# EAGLE design develboard (EAGLE 5.02)

## Sheet 1 of 7
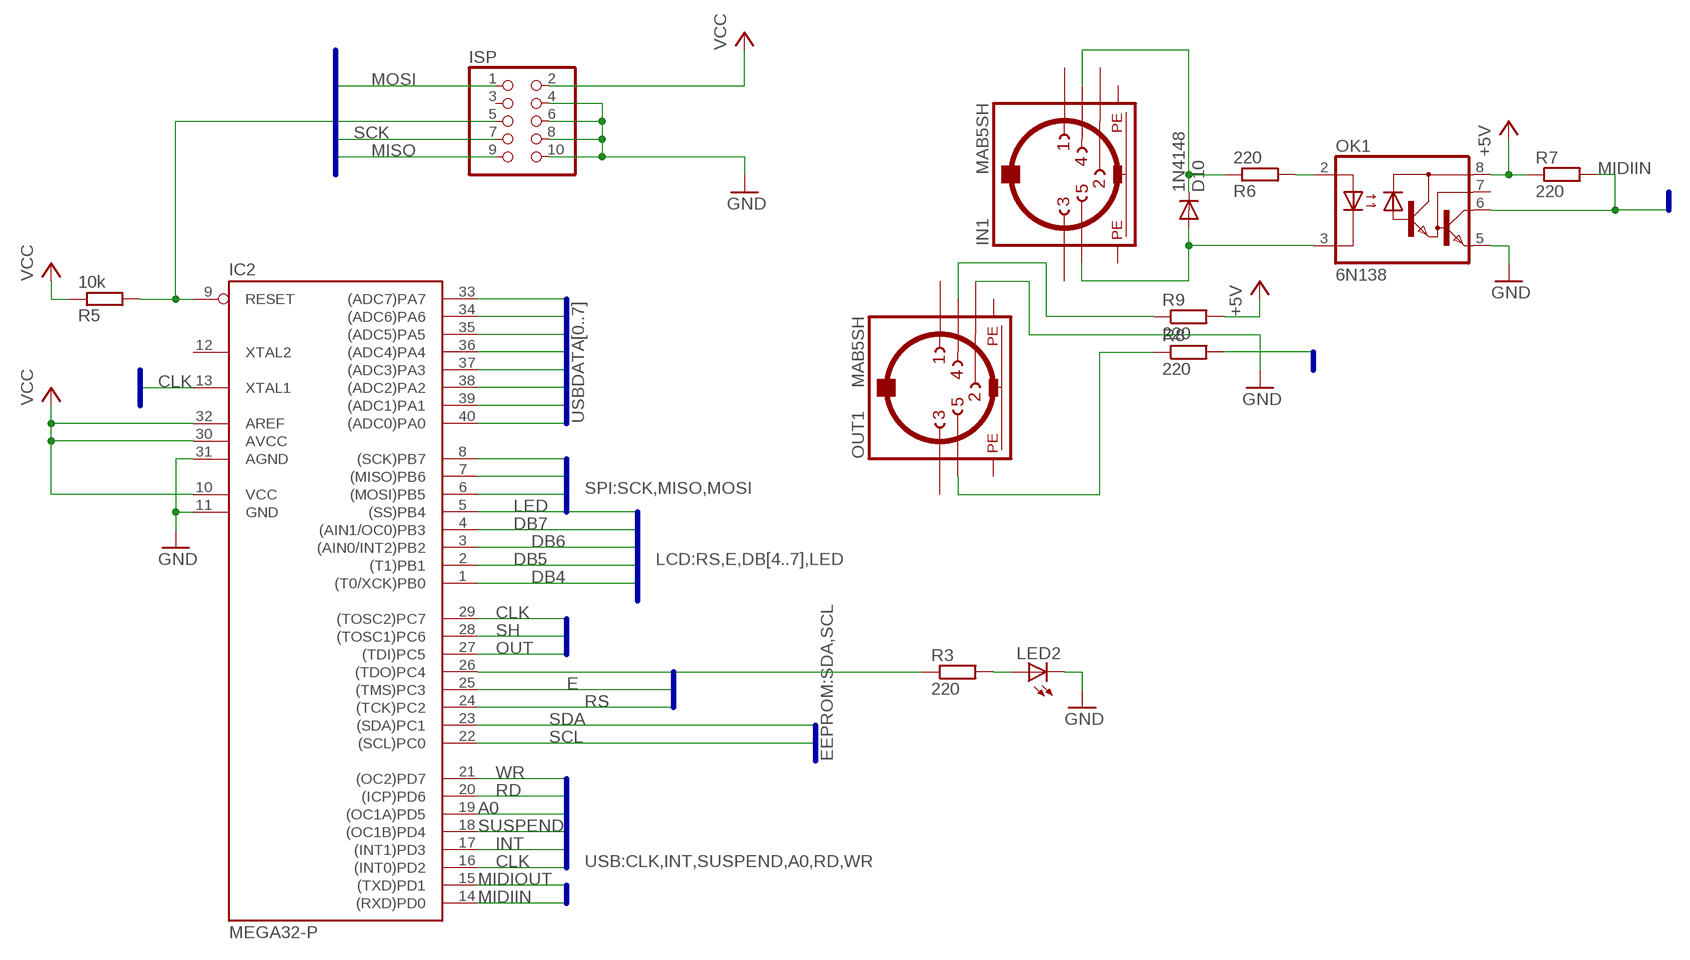
[diagram p0: schematic, sheet 1]

### Parts
D10  1N4148  [DO35-10]
IC2  MEGA32-P  [DIL40]
IN1  MAB5SH  [MAB5SH]
ISP  PINHD-2X5  [2X05]
LED2  LED5MM  [LED5MM]
OK1  6N138  [DIL08]
OUT1  MAB5SH  [MAB5SH]
R3  220  R-EU_0204/7  [0204/7]
R5  10k  R-EU_0204/7  [0204/7]
R6  220  R-EU_0204/7  [0204/7]
R7  220  R-EU_0204/7  [0204/7]
R8  220  R-EU_0204/7  [0204/7]
R9  220  R-EU_0204/7  [0204/7]

### Nets
A0: IC2.19((OC1A)PD5) ; also sheet 2
CLK: IC2.13(XTAL1) IC2.16((INT0)PD2) IC2.29((TOSC2)PC7) ; also sheet 2,6
DB4: IC2.1((T0/XCK)PB0) ; also sheet 7
DB5: IC2.2((T1)PB1) ; also sheet 7
DB6: IC2.3((AIN0/INT2)PB2) ; also sheet 7
DB7: IC2.4((AIN1/OC0)PB3) ; also sheet 7
E: IC2.25((TMS)PC3) ; also sheet 7
GND: IC2.11(GND) IC2.31(AGND) ISP.4 ISP.6 ISP.8 ISP.10 LED2.K(C) OK1.5(GND) OUT1.2 ; also sheet 2,3,4,5,6,7
INT: IC2.17((INT1)PD3) ; also sheet 2
LED: IC2.5((SS)PB4) ; also sheet 7
MIDIIN: IC2.14((RXD)PD0) OK1.6(VO) R7.2
MIDIOUT: IC2.15((TXD)PD1) R8.2
MISO: IC2.7((MISO)PB6) ISP.9
MOSI: IC2.6((MOSI)PB5) ISP.1
N$4: IC2.26((TDO)PC4) R3.1
N$7: LED2.A R3.2
N$10: D10.C IN1.4 R6.1
N$11: OUT1.4 R9.1
N$12: OUT1.5 R8.1
N$13: OK1.2(A) R6.2
N$20: D10.A IN1.5 OK1.3(C)
N$98: IC2.9(RESET) ISP.5 R5.2
OUT: IC2.27((TDI)PC5) ; also sheet 6
RD: IC2.20((ICP)PD6) ; also sheet 2
RS: IC2.24((TCK)PC2) ; also sheet 7
SCK: IC2.8((SCK)PB7) ISP.7
SCL: IC2.22((SCL)PC0) ; also sheet 7
SDA: IC2.23((SDA)PC1) ; also sheet 7
SH: IC2.28((TOSC1)PC6) ; also sheet 6
SUSPEND: IC2.18((OC1B)PD4) ; also sheet 2
USBDATA0: IC2.40((ADC0)PA0) ; also sheet 2
USBDATA1: IC2.39((ADC1)PA1) ; also sheet 2
USBDATA2: IC2.38((ADC2)PA2) ; also sheet 2
USBDATA3: IC2.37((ADC3)PA3) ; also sheet 2
USBDATA4: IC2.36((ADC4)PA4) ; also sheet 2
USBDATA5: IC2.35((ADC5)PA5) ; also sheet 2
USBDATA6: IC2.34((ADC6)PA6) ; also sheet 2
USBDATA7: IC2.33((ADC7)PA7) ; also sheet 2
VCC: IC2.10(VCC) IC2.30(AVCC) IC2.32(AREF) ISP.2 OK1.8(VCC) R5.1 R7.1 R9.2 ; supply symbol labelled +5V ; also sheet 2,3,4,5,6,7
WR: IC2.21((OC2)PD7) ; also sheet 2
Unconnected: IC2.12(XTAL2) IN1.1 IN1.2 IN1.3 ISP.3 OK1.7(VB) OUT1.1 OUT1.3

### Buses
MIDIOUT,MIDIIN
SPI:SCK,MISO,MOSI
SHR:CLK,SH,OUT
USBDATA[0..7]
USB:CLK,INT,SUSPEND,A0,RD,WR
EEPROM:SDA,SCL
LCD:RS,E,DB[4..7],LED

## Sheet 2 of 7
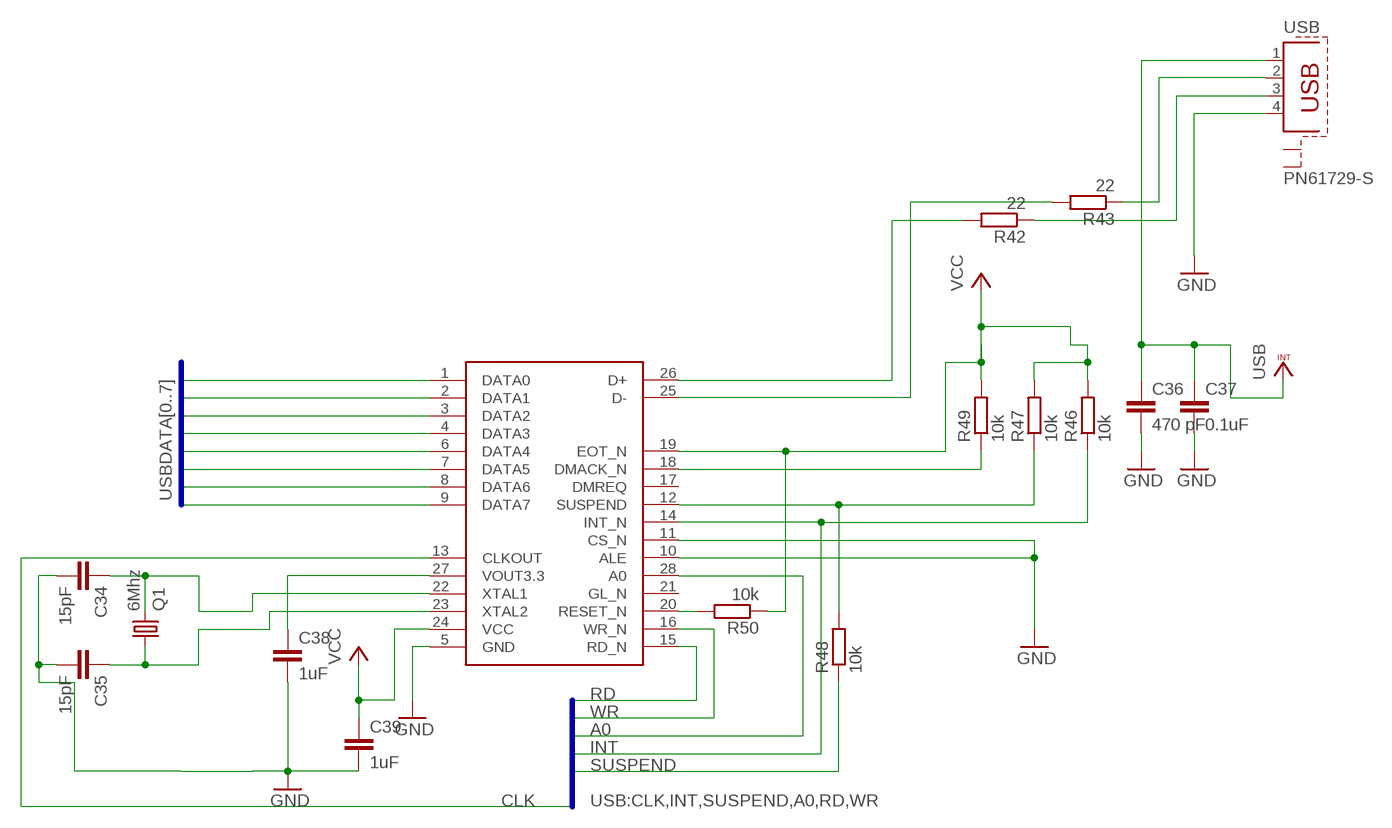
[diagram p1: schematic, sheet 2]

### Parts
C34  15pF  C-EUC0805  [C0805]
C35  15pF  C-EUC0805  [C0805]
C36  470 pF  C-EUC0805  [C0805]
C37  0.1uF  C-EUC0805  [C0805]
C38  1uF  C-EUC0805  [C0805]
C39  1uF  C-EUC0805  [C0805]
Q1  6Mhz  CRYSTALHC49S  [HC49/S]
R42  22  R-EU_R0805  [R0805]
R43  22  R-EU_R0805  [R0805]
R46  10k  R-EU_R0805  [R0805]
R47  10k  R-EU_R0805  [R0805]
R48  10k  R-EU_R0805  [R0805]
R49  10k  R-EU_R0805  [R0805]
R50  10k  R-EU_R0805  [R0805]
U$2  PDIUSBD12  [TSSOP28]
USB  PN61729-S  [PN61729-S]

### Nets
A0: U$2.28(A0) ; also sheet 1
CLK: U$2.13(CLKOUT) ; also sheet 1,6
GND: C34.2 C35.2 C36.2 C37.2 C38.2 C39.2 U$2.5(GND) U$2.10(ALE) U$2.11(CS_N) USB.4 ; also sheet 1,3,4,5,6,7
INT: R46.1 U$2.14(INT_N) ; also sheet 1
N$22: R43.1 USB.2
N$35: R49.1 U$2.18(DMACK_N)
N$36: R42.2 U$2.26(D+)
N$37: R43.2 U$2.25(D-)
N$38: C38.1 U$2.27(VOUT3.3)
N$45: R50.2 U$2.20(RESET_N)
N$46: C34.1 Q1.2 U$2.22(XTAL1)
N$47: C35.1 Q1.1 U$2.23(XTAL2)
N$48: R42.1 USB.3
N$51: R47.1 R48.2 U$2.12(SUSPEND)
RD: U$2.15(RD_N) ; also sheet 1
SUSPEND: R48.1 ; also sheet 1
USBDATA0: U$2.1(DATA0) ; also sheet 1
USBDATA1: U$2.2(DATA1) ; also sheet 1
USBDATA2: U$2.3(DATA2) ; also sheet 1
USBDATA3: U$2.4(DATA3) ; also sheet 1
USBDATA4: U$2.6(DATA4) ; also sheet 1
USBDATA5: U$2.7(DATA5) ; also sheet 1
USBDATA6: U$2.8(DATA6) ; also sheet 1
USBDATA7: U$2.9(DATA7) ; also sheet 1
VCC: C39.1 R46.2 R47.2 R49.2 R50.1 U$2.19(EOT_N) U$2.24(VCC) ; also sheet 1,3,4,5,6,7
VCCINT: C36.1 C37.1 USB.1 ; supply symbol labelled USB ; also sheet 3
WR: U$2.16(WR_N) ; also sheet 1
Unconnected: U$2.17(DMREQ) U$2.21(GL_N) USB.S1 USB.S2

### Buses
USBDATA[0..7]
USB:CLK,INT,SUSPEND,A0,RD,WR

## Sheet 3 of 7
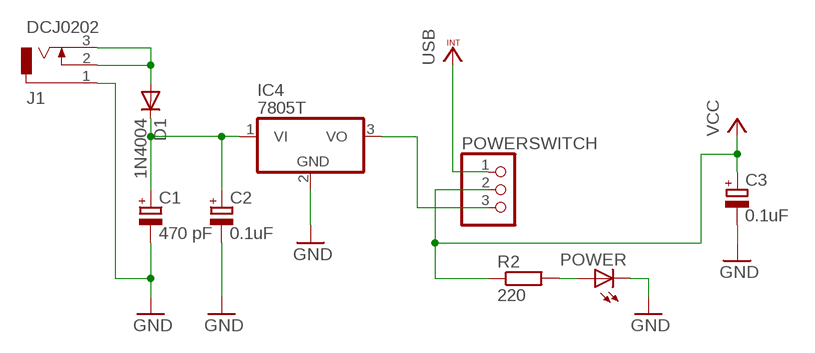
[diagram p2: schematic, sheet 3]

### Parts
C1  470 pF  CPOL-EUB45181B  [B45181B]
C2  0.1uF  CPOL-EUB45181B  [B45181B]
C3  0.1uF  CPOL-EUB45181B  [B45181B]
D1  1N4004  [DO41-10]
IC4  7805T  [TO220H]
J1  DCJ0202  [DCJ0202]
POWER  LED5MM  [LED5MM]
POWERSWITCH  PINHD-1X3  [1X03]
R2  220  R-EU_0204/7  [0204/7]

### Nets
GND: C1.- C2.- C3.- IC4.2(GND) J1.1 POWER.K(C) ; also sheet 1,2,4,5,6,7
N$3: D1.A J1.2 J1.3
N$5: POWER.A R2.2
N$21: C1.+ C2.+ D1.C IC4.1(VI)
N$23: IC4.3(VO) POWERSWITCH.3
VCC: C3.+ POWERSWITCH.2 R2.1 ; also sheet 1,2,4,5,6,7
VCCINT: POWERSWITCH.1 ; supply symbol labelled USB ; also sheet 2

## Sheet 4 of 7
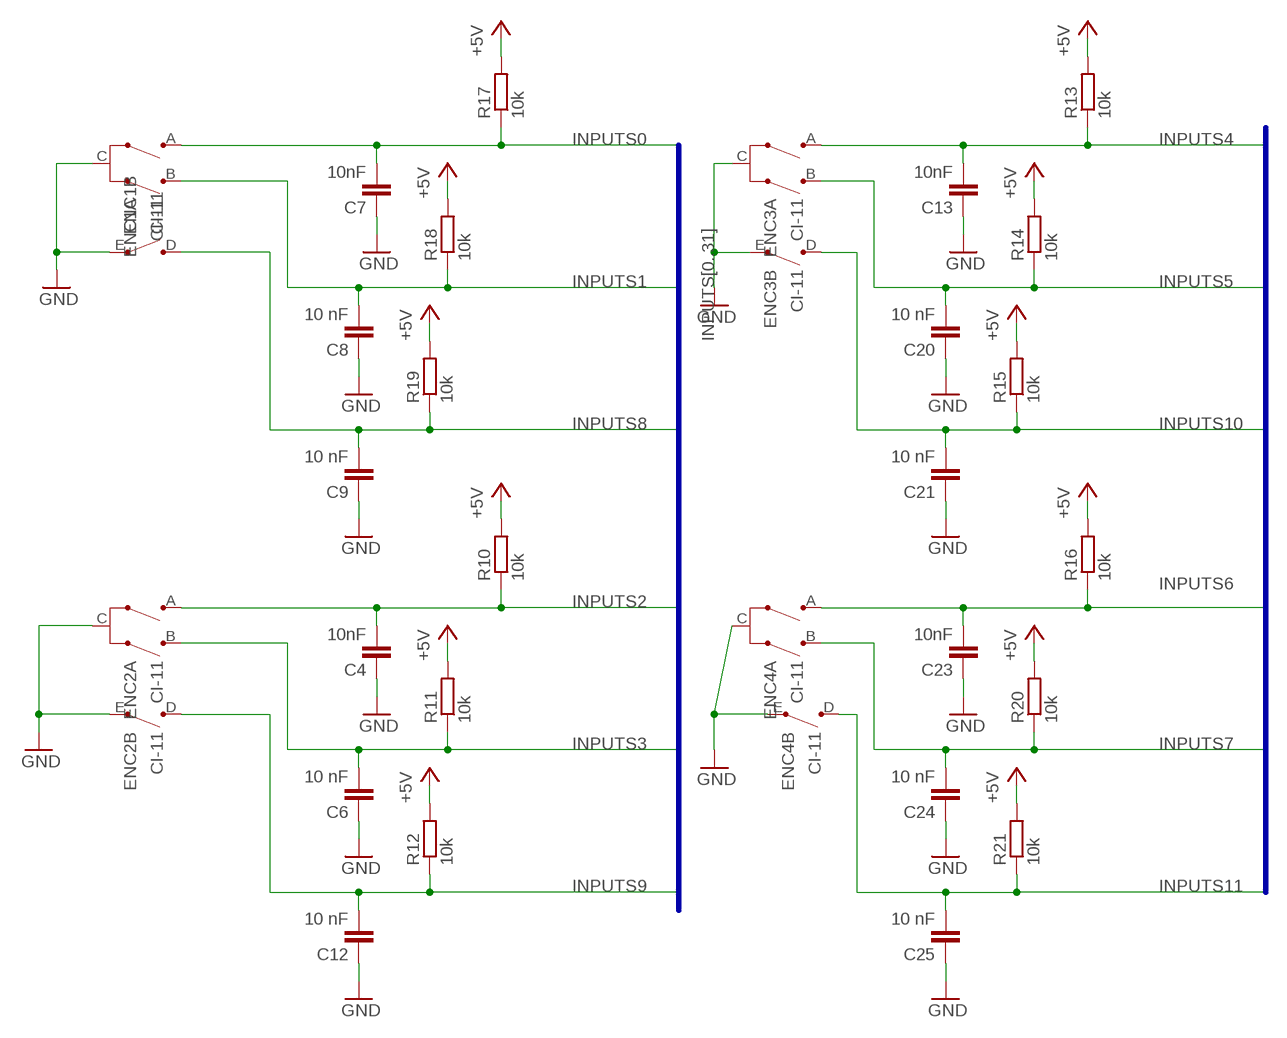
[diagram p3: schematic, sheet 4]

### Parts
C4  10nF  C-EU025-025X050  [C025-025X050]
C6  10 nF  C-EU025-025X050  [C025-025X050]
C7  10nF  C-EU025-025X050  [C025-025X050]
C8  10 nF  C-EU025-025X050  [C025-025X050]
C9  10 nF  C-EU025-025X050  [C025-025X050]
C12  10 nF  C-EU025-025X050  [C025-025X050]
C13  10nF  C-EU025-025X050  [C025-025X050]
C20  10 nF  C-EU025-025X050  [C025-025X050]
C21  10 nF  C-EU025-025X050  [C025-025X050]
C23  10nF  C-EU025-025X050  [C025-025X050]
C24  10 nF  C-EU025-025X050  [C025-025X050]
C25  10 nF  C-EU025-025X050  [C025-025X050]
ENC1  CI-11  [CI-11]
ENC2  CI-11  [CI-11]
ENC3  CI-11  [CI-11]
ENC4  CI-11  [CI-11]
R10  10k  R-EU_0204/7  [0204/7]
R11  10k  R-EU_0204/7  [0204/7]
R12  10k  R-EU_0204/7  [0204/7]
R13  10k  R-EU_0204/7  [0204/7]
R14  10k  R-EU_0204/7  [0204/7]
R15  10k  R-EU_0204/7  [0204/7]
R16  10k  R-EU_0204/7  [0204/7]
R17  10k  R-EU_0204/7  [0204/7]
R18  10k  R-EU_0204/7  [0204/7]
R19  10k  R-EU_0204/7  [0204/7]
R20  10k  R-EU_0204/7  [0204/7]
R21  10k  R-EU_0204/7  [0204/7]

### Nets
GND: C4.1 C6.1 C7.1 C8.1 C9.1 C12.1 C13.1 C20.1 C21.1 C23.1 C24.1 C25.1 ENC1.C(A:C) ENC1.E(B:E) ENC2.C(A:C) ENC2.E(B:E) ENC3.C(A:C) ENC3.E(B:E) ENC4.C(A:C) ENC4.E(B:E) ; also sheet 1,2,3,5,6,7
INPUTS0: C7.2 ENC1.A(A:A) R17.1 ; also sheet 6
INPUTS1: C8.2 ENC1.B(A:B) R18.1 ; also sheet 6
INPUTS2: C4.2 ENC2.A(A:A) R10.1 ; also sheet 6
INPUTS3: C6.2 ENC2.B(A:B) R11.1 ; also sheet 6
INPUTS4: C13.2 ENC3.A(A:A) R13.1 ; also sheet 6
INPUTS5: C20.2 ENC3.B(A:B) R14.1 ; also sheet 6
INPUTS6: C23.2 ENC4.A(A:A) R16.1 ; also sheet 6
INPUTS7: C24.2 ENC4.B(A:B) R20.1 ; also sheet 6
INPUTS8: C9.2 ENC1.D(B:D) R19.1 ; also sheet 6
INPUTS9: C12.2 ENC2.D(B:D) R12.1 ; also sheet 6
INPUTS10: C21.2 ENC3.D(B:D) R15.1 ; also sheet 6
INPUTS11: C25.2 ENC4.D(B:D) R21.1 ; also sheet 6
VCC: R10.2 R11.2 R12.2 R13.2 R14.2 R15.2 R16.2 R17.2 R18.2 R19.2 R20.2 R21.2 ; supply symbol labelled +5V ; also sheet 1,2,3,5,6,7

### Buses
INPUTS[0..31]

## Sheet 5 of 7
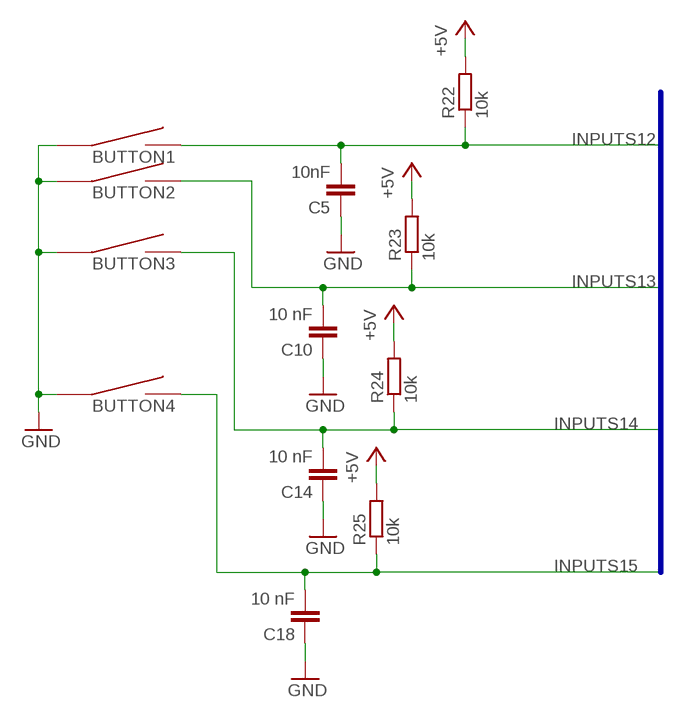
[diagram p4: schematic, sheet 5]

### Parts
BUTTON1  3FTL  [3FTL06]
BUTTON2  3FTL  [3FTL06]
BUTTON3  3FTL  [3FTL06]
BUTTON4  3FTL  [3FTL06]
C5  10nF  C-EU025-025X050  [C025-025X050]
C10  10 nF  C-EU025-025X050  [C025-025X050]
C14  10 nF  C-EU025-025X050  [C025-025X050]
C18  10 nF  C-EU025-025X050  [C025-025X050]
R22  10k  R-EU_0204/7  [0204/7]
R23  10k  R-EU_0204/7  [0204/7]
R24  10k  R-EU_0204/7  [0204/7]
R25  10k  R-EU_0204/7  [0204/7]

### Nets
GND: BUTTON1.A@1 BUTTON2.A@1 BUTTON3.A@1 BUTTON4.A@1 C5.1 C10.1 C14.1 C18.1 ; also sheet 1,2,3,4,6,7
INPUTS12: BUTTON1.B@1 C5.2 R22.1 ; also sheet 6
INPUTS13: BUTTON2.B@1 C10.2 R23.1 ; also sheet 6
INPUTS14: BUTTON3.B@1 C14.2 R24.1 ; also sheet 6
INPUTS15: BUTTON4.B@1 C18.2 R25.1 ; also sheet 6
VCC: R22.2 R23.2 R24.2 R25.2 ; supply symbol labelled +5V ; also sheet 1,2,3,4,6,7

### Buses
INPUTS[0..31]

## Sheet 6 of 7
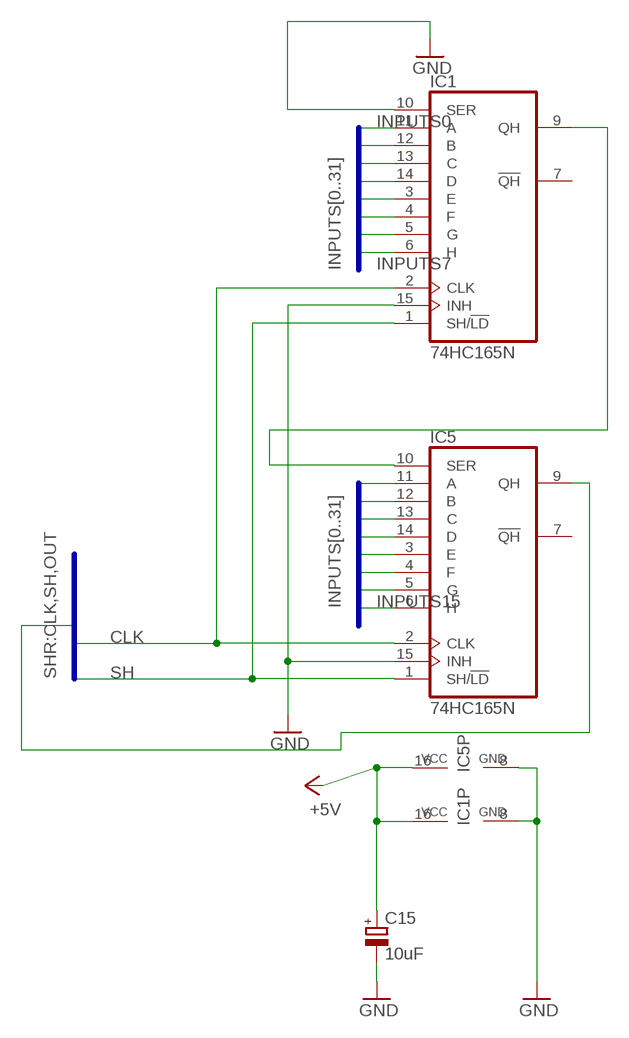
[diagram p5: schematic, sheet 6]

### Parts
C15  10uF  CPOL-EUB45181B  [B45181B]
IC1  74HC165N  [DIL16]
IC5  74HC165N  [DIL16]

### Nets
CLK: IC1.2(CLK) IC5.2(CLK) ; also sheet 1,2
GND: C15.- IC1.8(GND) IC1.10(SER) IC1.15(INH) IC5.8(GND) IC5.15(INH) ; also sheet 1,2,3,4,5,7
INPUTS0: IC1.11(A) ; also sheet 4
INPUTS1: IC1.12(B) ; also sheet 4
INPUTS2: IC1.13(C) ; also sheet 4
INPUTS3: IC1.14(D) ; also sheet 4
INPUTS4: IC1.3(E) ; also sheet 4
INPUTS5: IC1.4(F) ; also sheet 4
INPUTS6: IC1.5(G) ; also sheet 4
INPUTS7: IC1.6(H) ; also sheet 4
INPUTS8: IC5.11(A) ; also sheet 4
INPUTS9: IC5.12(B) ; also sheet 4
INPUTS10: IC5.13(C) ; also sheet 4
INPUTS11: IC5.14(D) ; also sheet 4
INPUTS12: IC5.3(E) ; also sheet 5
INPUTS13: IC5.4(F) ; also sheet 5
INPUTS14: IC5.5(G) ; also sheet 5
INPUTS15: IC5.6(H) ; also sheet 5
N$1: IC1.9(QH) IC5.10(SER)
OUT: IC5.9(QH) ; also sheet 1
SH: IC1.1(SH/!LD) IC5.1(SH/!LD) ; also sheet 1
VCC: C15.+ IC1.16(VCC) IC5.16(VCC) ; supply symbol labelled +5V ; also sheet 1,2,3,4,5,7
Unconnected: IC1.7(!QH) IC5.7(!QH)

### Buses
INPUTS[0..31]
SHR:CLK,SH,OUT

## Sheet 7 of 7
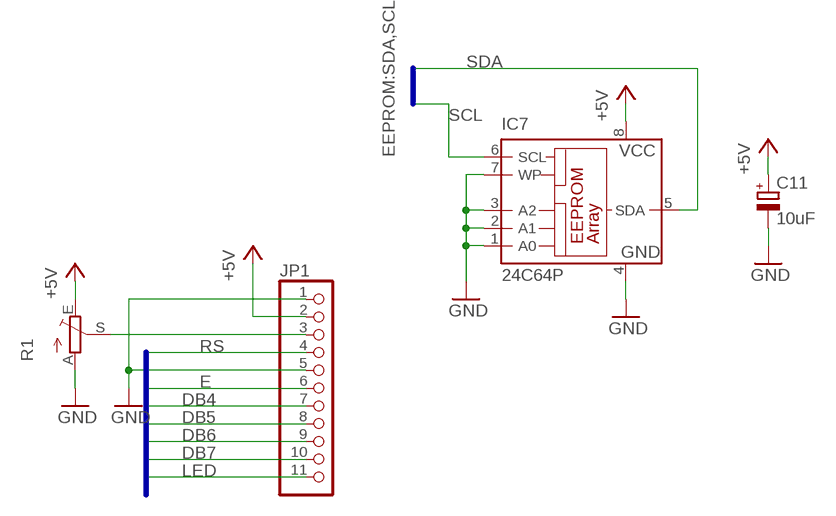
[diagram p6: schematic, sheet 7]

### Parts
C11  10uF  CPOL-EUB45181A  [B45181A]
IC7  24C64P  [DIL8]
JP1  PINHD-1X11  [1X11]
R1  TRIM_EU-CA6V  [CA6V]

### Nets
DB4: JP1.7 ; also sheet 1
DB5: JP1.8 ; also sheet 1
DB6: JP1.9 ; also sheet 1
DB7: JP1.10 ; also sheet 1
E: JP1.6 ; also sheet 1
GND: C11.- IC7.1(A0) IC7.2(A1) IC7.3(A2) IC7.4(GND) IC7.7(WP) JP1.1 JP1.5 R1.A ; also sheet 1,2,3,4,5,6
LED: JP1.11 ; also sheet 1
N$2: JP1.3 R1.S
RS: JP1.4 ; also sheet 1
SCL: IC7.6(SCL) ; also sheet 1
SDA: IC7.5(SDA) ; also sheet 1
VCC: C11.+ IC7.8(VCC) JP1.2 R1.E ; supply symbol labelled +5V ; also sheet 1,2,3,4,5,6

### Buses
LCD:RS,E,DB[4..7],LED
EEPROM:SDA,SCL

## Power pins joined to a net without a drawn wire
PE: IN1.PE IN1.PE@(PE) OUT1.PE OUT1.PE@(PE)

## Library data of the parts
BUTTON1-BUTTON4 = ruinwesen:3FTL
C1-C3 C11 C15 = rcl:CPOL-EU: POLARIZED CAPACITOR, European symbol
C4-C10 C12-C14 C18 C20 C21 C23-C25 C34-C39 = rcl:C-EU: CAPACITOR, European symbol
D1 = diode:1N4004: DIODE general purpose rectifier, 1 A
D10 = diode:1N4148: DIODE high speed (Philips)
ENC1-ENC4 = piher:CI-11: 11mm Incemental Encoder Source: www.piher.net .. 04-CI-11v04.pdf
IC1 IC5 = 74xx-eu:74*165: 8-bit parallel load SHIFT REGISTER
IC2 = atmel:MEGA32-P: MICROCONTROLLER 32 Kbytes FLASH 2 Kbytes SRAM 1 Kbytes EEPROM USART 8-channel 10 bit ADC Source: www.atmel.com .. doc2503.pdf
IC4 = linear:78*: Positive VOLTAGE REGULATOR Source: http://cache.national.com/ds/LM/LM78L05.pdf http://www.fairchildsemi.com/ds/LM/LM7805.pdf
IC7 = microchip:24*: Serial EEPROM I2C
IN1 OUT1 = con-hirschmann:MAB5SH: Female CONNECTOR 5 pins 90 deg. with shield, horizontal (DIN 41524)
ISP = pinhead:PINHD-2X5: PIN HEADER
J1 = con-jack:DCJ0202: DC POWER JACK Source: DCJ0202.pdf
JP1 = pinhead:PINHD-1X11: PIN HEADER
LED2 POWER = led:LED: LED OSRAM: - CHIPLED LG R971, LG N971, LY N971, LG Q971, LY Q971, LO R971, LY R971 LH N974, LH R974 LS Q976, LO Q976, LY Q976 LO Q996 - Hyper CHIPLED LW Q18S LB Q993, LB Q99A, LB R99A - SideLED LS A670, LO A670, LY A670, LG A670, LP A670 LB A673, LV A673, LT A673, LW A673 LH A674 LY A675 LS A676, LA A676, LO A676, LY A676, LW A676 LS A679, LY A679, LG A679 - Hyper Micro SIDELED® LS Y876, LA Y876, LO Y876, LY Y876 LT Y87S - SmartLED LW L88C, LW L88S LB L89C, LB L89S, LG L890 LS L89K, LO L89K, LY L89K LS L896, LA L896, LO L896, LY L896 - TOPLED LS T670, LO T670, LY T670, LG T670, LP T670 LSG T670, LSP T670, LSY T670, LOP T670, LYG T670 LG T671, LOG T671, LSG T671 LB T673, LV T673, LT T673, LW T673 LH T674 LS T676, LA T676, LO T676, LY T676, LB T676, LH T676, LSB T676, LW T676 LB T67C, LV T67C, LT T67C, LS T67K, LO T67K, LY T67K, LW E67C LS E67B, LA E67B, LO E67B, LY E67B, LB E67C, LV E67C, LT E67C LW T67C LS T679, LY T679, LG T679 LS T770, LO T770, LY T770, LG T770, LP T770 LB T773, LV T773, LT T773, LW T773 LH T774 LS E675, LA E675, LY E675, LS T675 LS T776, LA T776, LO T776, LY T776, LB T776 LHGB T686 LT T68C, LB T68C - Hyper Mini TOPLED® LB M676 - Mini TOPLED Santana® LG M470 LS M47K, LO M47K, LY M47K Source: http://www.osram.convergy.de - LUMILED® LXK2-PW12-R00, LXK2-PW12-S00, LXK2-PW14-U00, LXK2-PW14-V00 LXK2-PM12-R00, LXK2-PM12-S00, LXK2-PM14-U00 LXK2-PE12-Q00, LXK2-PE12-R00, LXK2-PE12-S00, LXK2-PE14-T00, LXK2-PE14-U00 LXK2-PB12-K00, LXK2-PB12-L00, LXK2-PB12-M00, LXK2-PB14-N00, LXK2-PB14-P00, LXK2-PB14-Q00 LXK2-PR12-L00, LXK2-PR12-M00, LXK2-PR14-Q00, LXK2-PR14-R00 LXK2-PD12-Q00, LXK2-PD12-R00, LXK2-PD12-S00 LXK2-PH12-R00, LXK2-PH12-S00 LXK2-PL12-P00, LXK2-PL12-Q00, LXK2-PL12-R00 Source: www.luxeon.com
OK1 = optocoupler:6N138: MOTOROLA OPTO COUPLER
POWERSWITCH = pinhead:PINHD-1X3: PIN HEADER
Q1 = crystal:CRYSTAL: CRYSTAL
R1 = pot:TRIM_EU-: POTENTIOMETER
R2 R3 R5-R25 R42 R43 R46-R50 = rcl:R-EU_: RESISTOR, European symbol
U$2 = philips:PDIUSBD12
USB = con-berg:PN61729-S: BERG USB connector

## Board
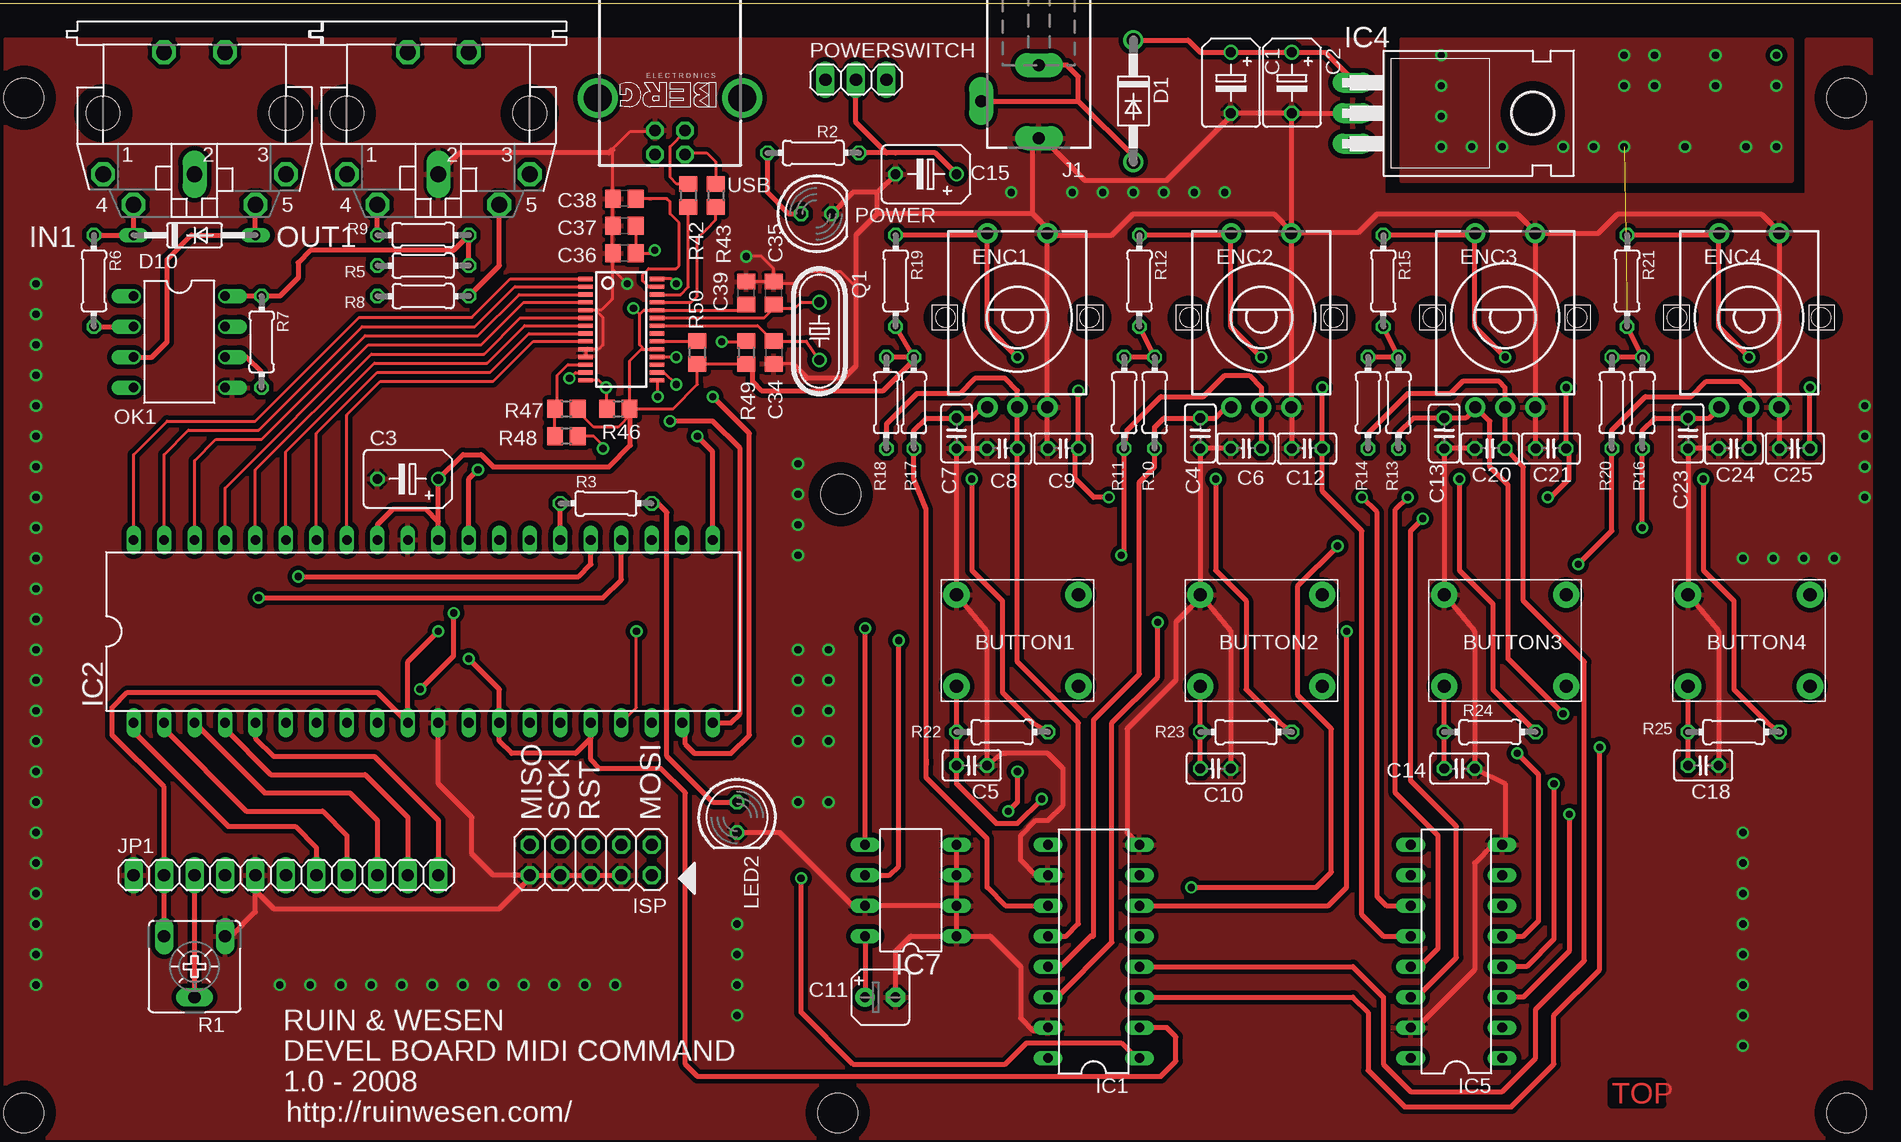
[diagram p7: board, top side]
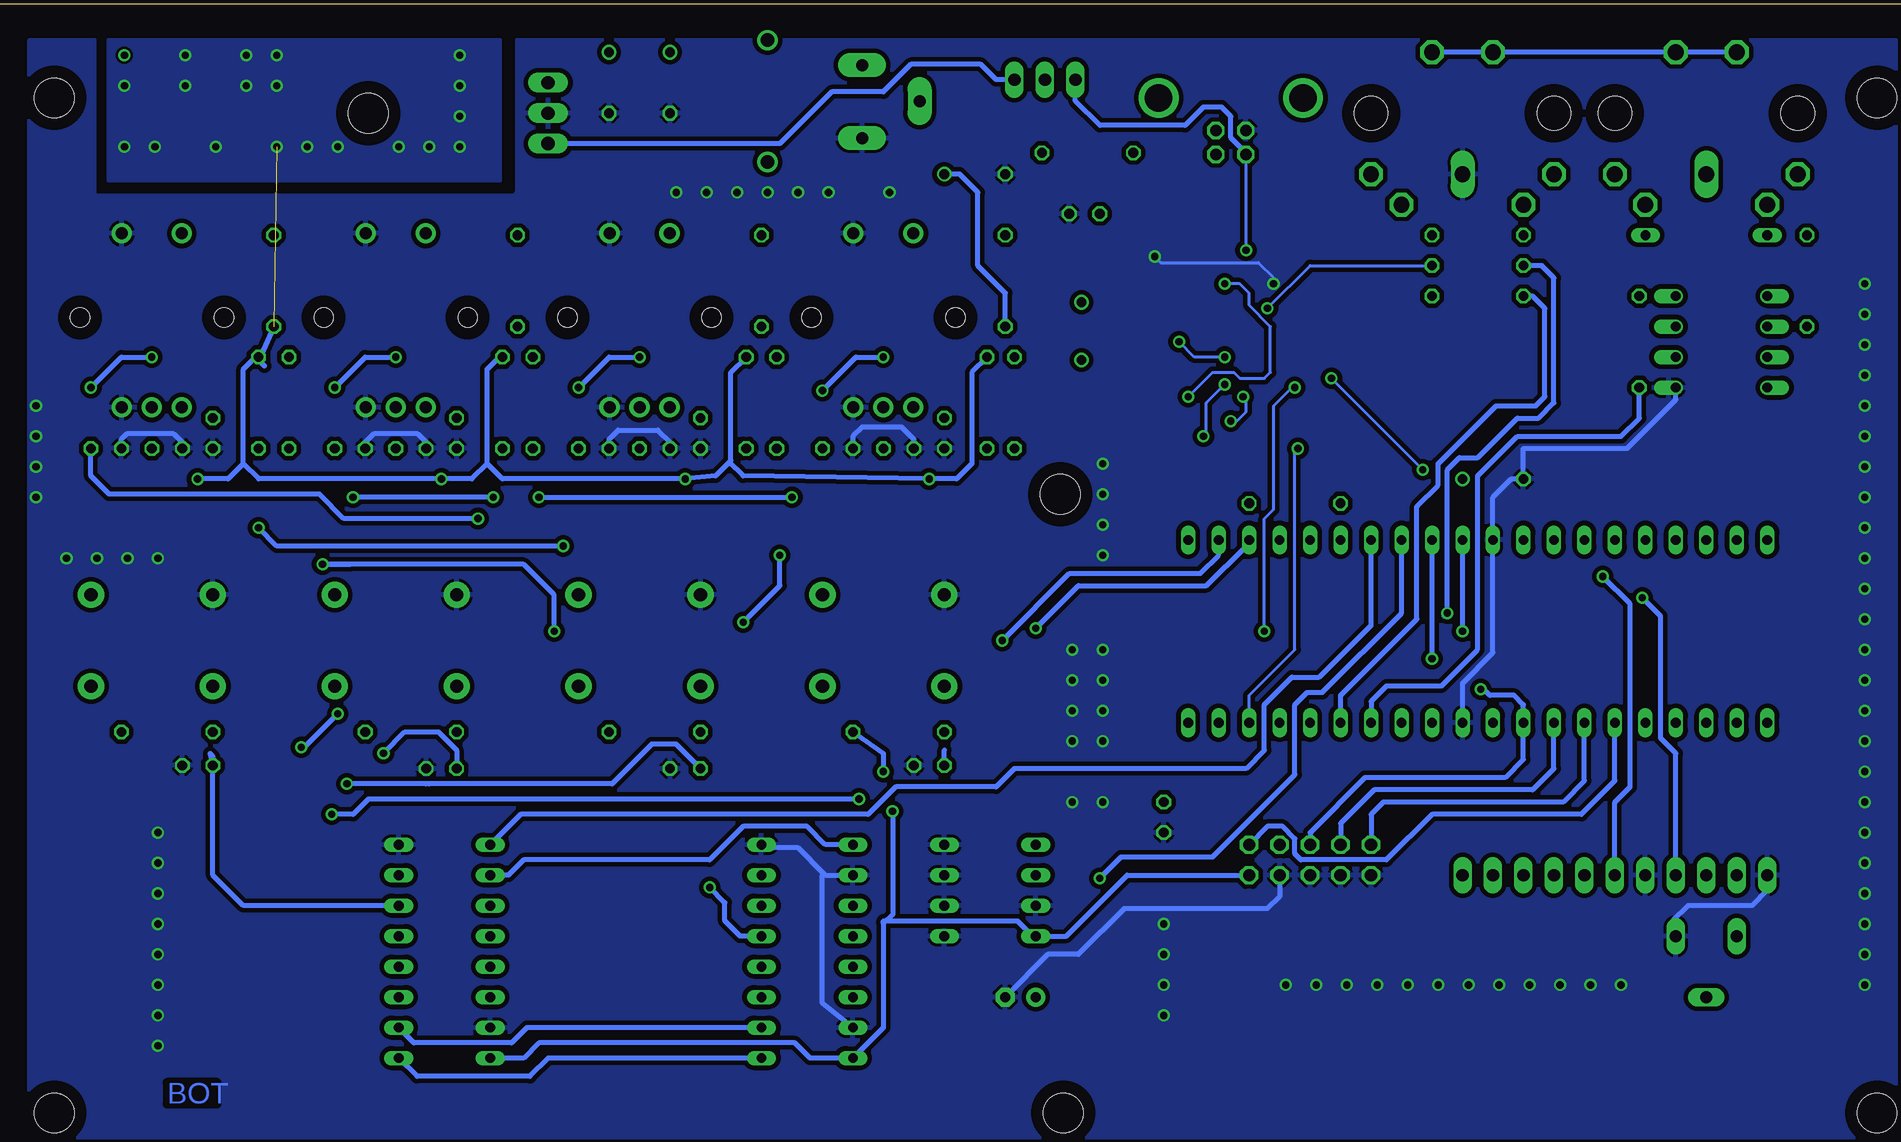
[diagram p8: board, bottom side, seen from below]

No outline drawn. Coordinates in mm, seen from the top.
Copper layers (1*16): Top 0.035mm / dielectric 1.5mm / Bottom 0.035mm
Design rules "pcb-pool *": minimum track width 8mil, minimum drill 12mil, track to track 8mil, track to pad 8mil, pad to pad 8mil, via to via 8mil, smd to smd 8mil, copper to edge 40mil, drill to drill 20mil, minimum pad ring 8mil, minimum via ring 8mil, stop-mask expansion 8mil, vias tented up to drill 0mil, thermal gap 10mil
Holes 3.3 mm at 4.57,89.15 156.46,89.15 4.57,4.57 156.46,4.57 72.64,56.13 72.39,4.57
Milling: 4 lines

### Footprints (pad centres in the part's own frame; a part is rotated, then mirrored left to right if it is on the bottom)
3FTL06 = drill 1.1 pad 2.184 round: A@1 -5.08,3.81; A@2 5.08,3.81; B@1 -5.08,-3.81; B@2 5.08,-3.81
B45181B = drill 0.813 round: + -2.54,0 | drill 0.813 octagon: - 2.54,0
C025-025X050 = drill 0.813 octagon: 1 -1.27,0; 2 1.27,0
B45181A = drill 0.813 pad 1.6 round: + -1.27,0 | drill 0.813 pad 1.6 octagon: - 1.27,0
C0805 = smd 1.3 x 1.5: 1 -0.95,0; 2 0.95,0
DO41-10 = drill 1.118 round: A 5.08,0; C -5.08,0
DO35-10 = drill 0.813 long: A 5.08,0; C -5.08,0
CI-11 = drill 1 pad 1.676 round: A -2.5,-7.5; B 0,-7.5; C 2.5,-7.5; D -2.5,7; E 2.5,7 | hole 1.6: -6,0; 6,0
DIL16 = drill 0.813 long: 1 -8.89,-3.81; 2 -6.35,-3.81; 3 -3.81,-3.81; 4 -1.27,-3.81; 5 1.27,-3.81; 6 3.81,-3.81; 7 6.35,-3.81; 8 8.89,-3.81; 9 8.89,3.81; 10 6.35,3.81; 11 3.81,3.81; 12 1.27,3.81; 13 -1.27,3.81; 14 -3.81,3.81; 15 -6.35,3.81; 16 -8.89,3.81
DIL40 = drill 0.813 long: 1 -24.13,-7.62; 2 -21.59,-7.62; 3 -19.05,-7.62; 4 -16.51,-7.62; 5 -13.97,-7.62; 6 -11.43,-7.62; 7 -8.89,-7.62; 8 -6.35,-7.62; 9 -3.81,-7.62; 10 -1.27,-7.62; 11 1.27,-7.62; 12 3.81,-7.62; 13 6.35,-7.62; 14 8.89,-7.62; 15 11.43,-7.62; 16 13.97,-7.62; 17 16.51,-7.62; 18 19.05,-7.62; 19 21.59,-7.62; 20 24.13,-7.62; 21 24.13,7.62; 22 21.59,7.62; 23 19.05,7.62; 24 16.51,7.62; 25 13.97,7.62; 26 11.43,7.62; 27 8.89,7.62; 28 6.35,7.62; 29 3.81,7.62; 30 1.27,7.62; 31 -1.27,7.62; 32 -3.81,7.62; 33 -6.35,7.62; 34 -8.89,7.62; 35 -11.43,7.62; 36 -13.97,7.62; 37 -16.51,7.62; 38 -19.05,7.62; 39 -21.59,7.62; 40 -24.13,7.62
TO220H = drill 1.118 long: 1 -2.54,-10.16; 2 0,-10.16; 3 2.54,-10.16 | hole 3.302: 0,4.826
DIL8 = drill 0.813 long: 1 -3.81,-3.81; 2 -1.27,-3.81; 3 1.27,-3.81; 4 3.81,-3.81; 5 3.81,3.81; 6 1.27,3.81; 7 -1.27,3.81; 8 -3.81,3.81
MAB5SH = drill 1.321 octagon: 1 7.62,5.08; 3 -7.62,5.08; 4 5.08,7.62; 5 -5.08,7.62; PE -2.54,-5.08; PE@ 2.54,-5.08 | drill 1.321 long: 2 0,5.08 | hole 2.794: 7.62,0; -7.62,0
2X05 = drill 1.016 octagon: 1 -5.08,-1.27; 2 -5.08,1.27; 3 -2.54,-1.27; 4 -2.54,1.27; 5 0,-1.27; 6 0,1.27; 7 2.54,-1.27; 8 2.54,1.27; 9 5.08,-1.27; 10 5.08,1.27
DCJ0202 = drill 1 pad 2 long: 1 0,3.1; 2 4.8,0; 3 0,-3
1X11 = drill 1.016 long: 1 -12.7,0; 2 -10.16,0; 3 -7.62,0; 4 -5.08,0; 5 -2.54,0; 6 0,0; 7 2.54,0; 8 5.08,0; 9 7.62,0; 10 10.16,0; 11 12.7,0
LED5MM = drill 0.813 octagon: A -1.27,0; K 1.27,0
DIL08 = drill 0.813 offset: 1 -3.81,-3.81; 2 -1.27,-3.81; 3 1.27,-3.81; 4 3.81,-3.81; 5 3.81,3.81; 6 1.27,3.81; 7 -1.27,3.81; 8 -3.81,3.81
1X03 = drill 1.016 long: 1 -2.54,0; 2 0,0; 3 2.54,0
HC49/S = drill 0.813 round: 1 -2.413,0; 2 2.413,0
CA6V = drill 1.016 long: A -2.54,-2.54; E 2.54,-2.54; S 0,2.54
0204/7 = drill 0.813 octagon: 1 -3.81,0; 2 3.81,0
R0805 = smd 1.3 x 1.5: 1 -0.95,0; 2 0.95,0
TSSOP28 = smd 0.35 x 1.2: 1 -2.955,-2.975; 2 -2.305,-2.975; 3 -1.655,-2.975; 4 -1.005,-2.975; 5 -0.355,-2.975; 6 0.295,-2.975; 7 0.945,-2.975; 8 1.595,-2.975; 9 2.245,-2.975; 10 2.895,-2.975; 11 3.545,-2.975; 12 4.195,-2.975; 13 4.845,-2.975; 14 5.495,-2.975; 15 5.495,2.975; 16 4.845,2.975; 17 4.195,2.975; 18 3.545,2.975; 19 2.895,2.975; 20 2.245,2.975; 21 1.595,2.975; 22 0.945,2.975; 23 0.295,2.975; 24 -0.355,2.975; 25 -1.005,2.975; 26 -1.655,2.975; 27 -2.305,2.975; 28 -2.955,2.975
PN61729-S = drill 0.95 octagon: 1 1.25,4.71; 2 -1.25,4.71; 3 -1.25,2.71; 4 1.25,2.71 | drill 2.3 pad 2.9 round: S1 -6.02,0; S2 6.02,0

### Placement (x,y rotation side)
BUTTON1  87.38,43.94 0 top
BUTTON2  107.7,43.94 0 top
BUTTON3  128.02,43.94 0 top
BUTTON4  148.34,43.94 0 top
C1  105.16,90.42 270 top
C2  110.24,90.42 270 top
C3  36.58,57.4 180 top
C4  102.62,61.21 90 top
C5  83.57,33.53 180 top
C6  106.43,59.94 0 top
C7  82.3,61.21 90 top
C8  86.11,59.94 0 top
C9  91.19,59.94 0 top
C10  103.89,33.27 180 top
C11  75.95,14.22 0 top
C12  111.51,59.94 0 top
C13  122.94,61.21 90 top
C14  124.21,33.27 180 top
C15  79.76,82.8 180 top
C18  144.53,33.53 180 top
C20  126.75,59.94 0 top
C21  131.83,59.94 0 top
C23  143.26,61.21 90 top
C24  147.07,59.94 0 top
C25  152.15,59.94 0 top
C34  67.06,67.94 270 top
C35  67.06,72.9 90 top
C36  54.61,76.2 180 top
C37  54.61,78.49 180 top
C38  54.61,80.77 180 top
C39  64.77,72.9 90 top
D1  97.03,88.9 270 top
D10  18.8,77.72 0 top
ENC1  87.38,70.87 0 top
ENC2  107.7,70.87 0 top
ENC3  128.02,70.87 0 top
ENC4  148.34,70.87 0 top
IC1  93.73,18.03 90 top
IC2  37.85,44.7 0 top
IC4  125.48,87.88 270 top
IC5  123.95,18.03 90 top
IC7  78.49,23.11 90 top
IN1  18.8,87.88 180 top
ISP  51.82,25.65 180 top
J1  89.15,88.9 180 top
JP1  26.42,24.38 0 top
LED2  64.01,29.21 270 top
OK1  17.53,68.83 270 top
OUT1  39.12,87.88 180 top
POWER  70.61,79.5 0 top
POWERSWITCH  73.91,90.68 0 top
Q1  70.87,69.72 270 top
R1  18.8,16.76 180 top
R2  70.36,84.58 180 top
R3  53.09,55.37 0 top
R5  37.85,75.18 180 top
R6  10.41,73.91 270 top
R7  24.38,68.83 270 top
R8  37.85,72.64 180 top
R9  37.85,77.72 0 top
R10  98.81,63.75 90 top
R11  96.27,63.75 90 top
R12  97.54,73.91 270 top
R13  119.13,63.75 90 top
R14  116.59,63.75 90 top
R15  117.86,73.91 270 top
R16  139.45,63.75 90 top
R17  78.74,63.75 90 top
R18  76.45,63.75 90 top
R19  77.22,73.91 270 top
R20  136.91,63.75 90 top
R21  138.18,73.91 270 top
R22  86.11,36.32 0 top
R23  106.43,36.32 0 top
R24  126.75,36.32 0 top
R25  147.07,36.32 0 top
R42  59.94,81.03 270 top
R43  62.23,81.03 270 top
R46  54.1,63.25 0 top
R47  49.78,63.25 0 top
R48  49.78,60.96 180 top
R49  64.77,67.94 270 top
R50  60.71,67.94 90 top
U$2  54.36,71.12 270 top
USB  58.42,89.15 180 top

### Tracks (layer width: path | path; a pad name or v marks a point on that pad's centre or on a via)
A0  (via drill 0.6)
  Top 0.254: U$2.28 58.51,74.08 v58.93,73.66
  Top 0.406: v61.98,64.26 65.02,61.21 65.02,36.07 63.5,34.54 60.45,34.54 59.69,35.31 59.69,36.83 IC2.19
  Bottom 0.254: v58.93,73.66 57.66,73.66 56.9,72.9 56.9,71.88 55.12,70.1 55.12,66.29 55.63,65.79 57.66,65.79 58.17,66.29 59.94,66.29 v61.98,64.26
CLK  (via drill 0.6)
  Top 0.254: U$2.13 50.53,66.28 v50.04,65.79
  Top 0.406: IC2.29 41.66,57.4 v42.42,58.17 | IC2.13 44.2,36.83 | IC2.13 44.2,39.88 v41.66,42.42 | IC2.13 44.2,35.56 45.21,34.54 50.55,34.54 51.82,35.81 IC2.16 51.82,34.04 52.58,33.27 57.66,33.27 59.69,31.24 59.69,8.64 60.71,7.62 99.31,7.62 100.58,8.89 100.58,10.92 99.82,11.68 IC1.2
  Bottom 0.254: v42.42,58.17 v50.04,65.79
  Bottom 0.406: IC1.2 117.09,11.68 118.36,10.41 126.49,10.41 IC5.2 | v41.66,42.42 IC2.29
DB4
  Top 0.406: IC2.1 13.72,36.32 21.59,28.45 27.18,28.45 28.96,26.67 JP1.7
DB5
  Top 0.406: IC2.2 16.26,36.58 23.11,29.72 29.46,29.72 31.5,27.69 JP1.8 31.5,24.13
DB6
  Top 0.406: IC2.3 24.64,31.24 31.75,31.24 34.04,28.96 JP1.9
DB7
  Top 0.406: IC2.4 21.34,36.58 25.15,32.77 33.02,32.77 36.58,29.21 36.58,25.15 36.07,24.64 JP1.10
E  (via drill 0.6)
  Top 0.406: v27.43,49.28 50.8,49.28 51.82,50.29 IC2.25
  Bottom 0.406: JP1.6 26.42,30.48 25.15,31.75 25.15,46.99 v27.43,49.28
GND  (via drill 0.6)
  Top 0.254: USB.4 57.17,86.38 57.15,86.36 55.12,86.36 53.66,84.9 53.66,84.84 C38.2 53.66,78.3 | 53.59,76.2 53.59,78.23 | 52.22,71.47 U$2.5 | 52.22,71.47 52.83,70.87 52.83,68.58 52.48,68.22 U$2.10 51.46,68.22 | 51.46,68.22 51.56,68.33 | U$2.11 51.38,68.14 51.46,68.22 | C35.2 67.06,73.66 67.24,73.85 C35.2 | C35.2 C39.2 | 52.22,71.47 52.68,71.47 53.59,72.39 53.59,76.2 | 53.59,76.2 C36.2 53.66,74.86 v54.86,73.66 | 68.64,67 C34.2 | 73.91,66.8 73.91,73.41 72.64,74.68 69.85,74.68 68.83,73.66 67.31,73.66 67.12,73.85 C35.2 | v64.77,75.95 66.04,75.95 67.06,74.93 C35.2 | 90.17,77.98 90.06,77.87 ENC1.E
  Top 0.406: C8.1 C7.1 82.04,59.94 82.3,59.69 BUTTON1.A@1 84.84,44.7 C5.1 86.11,34.54 | C9.1 89.88,59.98 ENC1.C 89.88,77.68 | 89.88,77.68 ENC1.E | 89.88,77.68 89.92,77.72 95.25,77.72 97.03,79.5 108.71,79.5 110.24,77.98 | C6.1 C4.1 BUTTON2.A@1 | C12.1 110.24,63.25 110.2,63.21 ENC2.C ENC2.E 110.2,77.94 110.24,77.98 | ENC3.C 130.52,63.03 130.56,62.99 | ENC3.E ENC3.C | C21.1 130.56,59.69 130.52,59.73 ENC3.C | C20.1 C13.1 | ENC4.C 150.84,63.29 150.88,63.25 | ENC4.C ENC4.E 150.99,77.87 | ENC4.C 150.84,59.98 C25.1 | C24.1 C23.1 143,59.94 143.26,59.69 BUTTON4.A@1 145.8,44.7 C18.1 | BUTTON2.A@1 105.16,44.7 C10.1 | C13.1 BUTTON3.A@1 125.48,44.7 C14.1 128.02,32 128.02,27.43 127.51,26.92 | C13.1 123.19,60.2 | IC5.15 120.65,11.68 125.48,16.51 125.48,25.4 127,26.92 127.51,26.92 | 128.02,26.67 IC5.8 127.51,26.92 | IC1.10 88.9,24.38 87.63,25.65 87.63,27.69 88.9,28.96 89.92,28.96 91.19,30.23 91.19,33.27 89.92,34.54 86.11,34.54 | 86.11,34.54 86.36,34.54 | BUTTON2.A@1 102.36,47.24 100.58,45.47 100.58,40.64 96.52,36.58 96.52,27.94 IC1.8 | ENC3.E 135.78,77.87 137.41,79.5 149.35,79.5 150.99,77.87 | 150.99,77.87 151.13,77.72 | 110.24,77.98 115.82,77.98 117.35,79.5 129.03,79.5 130.56,77.98 130.52,77.94 ENC3.E | IC2.11 39.12,32 41.91,29.21 41.91,26.16 43.69,24.38 ISP.10 | ISP.10 ISP.8 ISP.6 | ISP.6 52.07,24.38 | ISP.6 ISP.4 54.61,24.13 | IC7.2 82.04,21.84 82.3,21.59 IC7.1 | IC7.2 IC7.3 IC7.4 | IC7.2 IC7.7 73.66,21.84 67.56,27.94 LED2.K | C11.- 77.22,18.03 78.49,19.3 IC7.1 | OUT1.2 40.89,84.58 53.34,84.58 53.59,84.84 53.66,84.84 | C37.2 53.66,78.3 53.59,78.23 53.34,78.49 | 68.64,67 69.85,65.79 72.9,65.79 73.91,66.8 73.91,77.72 75.69,79.5
  Top 0.406: R1.A 21.84,19.3 23.88,21.34 23.88,24.13 24.13,24.38 JP1.5 23.88,23.11 25.4,21.59 44.2,21.59 46.74,24.13 ISP.10 | 88.65,79.5 75.69,79.5 | 90.17,77.98 88.65,79.5 | IC7.1 85.09,19.3 87.63,16.76 87.63,12.45 88.65,11.43 89.66,11.43 IC1.15 | 75.69,79.5 75.69,81.28 | 75.69,81.28 C15.- | 88.65,79.5 88.65,85.34 89.15,85.85 J1.1 89.46,85.8 92.96,82.3 99.82,82.3 105.16,87.63 C1.- | C2.- IC4.2 | C1.- 104.9,87.88 | C2.- C1.- | 110.24,77.98 C2.- | 110.24,77.98 109.98,77.72 | 75.69,81.28 73.66,81.28 POWER.K
  Bottom 0.254: v54.86,73.66 54.86,74.17 56.13,75.44 64.26,75.44 v64.77,75.95
  Bottom 0.406: C6.1 105.16,60.45 106.17,61.47 109.47,61.47 110.24,60.71 C12.1 | C8.1 84.84,60.71 85.85,61.72 89.15,61.72 89.92,60.96 C9.1 | C20.1 125.48,60.45 126.24,61.21 129.79,61.21 130.56,60.45 C21.1 | C24.1 145.8,60.45 146.56,61.21 150.37,61.21 150.88,60.71 C25.1 | IC1.10 92.2,24.38 92.33,24.51 | 92.33,24.51 94.49,26.67 97.54,26.67 97.79,26.92 | IC1.15 92.46,13.72 92.46,24.38 92.33,24.51 | IC2.31 36.58,42.93 39.12,40.39 39.12,37.34 39.37,37.08 IC2.11 | OK1.5 21.34,64.01 25.4,59.94 34.04,59.94 C3.- 35.05,57.4 36.58,55.88 IC2.31 | IC2.31 36.32,52.32 36.58,52.58 | JP1.1 13.72,23.11 14.99,21.84 20.32,21.84 21.59,20.57 21.59,19.05 R1.A | ISP.4 54.36,22.61 55.37,21.59 67.31,21.59 71.12,17.78 73.66,17.78 C11.- | IC2.31 36.32,52.07
  other vias: 5.59,22.86 5.59,20.32 5.59,17.78 5.59,15.24 86.87,81.28 91.95,81.28 94.49,81.28 97.03,81.28 99.57,81.28 102.11,81.28 104.65,81.28 157.99,63.5 157.99,60.96 157.99,58.42 157.99,55.88 147.83,50.8 150.37,50.8 152.91,50.8 155.45,50.8 147.83,27.94 147.83,25.4 147.83,22.86 147.83,20.32 147.83,10.16 147.83,12.7 147.83,15.24 147.83,17.78 64.01,20.32 64.01,17.78 64.01,15.24 64.01,12.7 69.09,43.18 69.09,40.64 69.09,38.1 69.09,35.56 69.09,30.48 71.63,30.48 71.63,43.18 71.63,40.64 71.63,38.1 71.63,35.56 69.09,58.67 69.09,56.13 69.09,53.59 69.09,51.05 5.59,33.02 5.59,30.48 5.59,27.94 5.59,25.4 5.59,43.18 5.59,40.64 5.59,38.1 5.59,35.56 5.59,53.34 5.59,50.8 5.59,48.26 5.59,45.72 5.59,63.5 5.59,60.96 5.59,58.42 5.59,55.88 5.59,73.66 5.59,71.12 5.59,68.58 5.59,66.04 25.91,15.24 28.45,15.24 30.99,15.24 33.53,15.24 36.07,15.24 38.61,15.24 41.15,15.24 43.69,15.24 46.23,15.24 48.77,15.24 51.31,15.24 53.85,15.24
  pour Top (isolate 0.381): 3.05,93.98 3.05,2.54 158.5,2.54 158.5,93.98 153.16,93.98 153.16,81.03 117.86,81.03 117.86,93.98
  pour Bottom (isolate 0.381): 3.05,93.98 3.05,2.54 158.5,2.54 158.5,93.98 153.16,93.98 153.16,81.03 118.11,81.03 117.86,81.28 117.86,93.98
INPUTS0
  Top 0.406: 84.88,63.03 84.84,62.99 | 84.88,63.03 ENC1.A | 84.88,63.03 84.11,63.03 83.57,62.48 C7.2 | C7.2 82.04,62.48 | R17.1 78.74,61.47 79.76,62.48 C7.2 | 79.76,34.04 79.76,33.53 | R17.1 78.74,57.4 79.76,54.86 79.76,34.04 | R17.1 78.99,60.2 | IC1.11 86.36,21.84 84.84,23.37 84.84,27.43 80.52,31.75 | 80.52,31.75 80.01,32.26 | 79.76,34.04 79.76,32.51 80.52,31.75
INPUTS1
  Top 0.406: 87.38,60.2 ENC1.B 87.38,64.77 86.36,65.79 83.82,65.79 82.55,64.52 78.99,64.52 76.45,61.98 R18.1 | IC1.12 91.44,19.3 92.46,20.32 92.46,37.08 87.38,42.16 87.38,60.2 | 87.38,60.2 C8.2
INPUTS2
  Top 0.406: ENC2.A 104.51,63.11 103.89,62.48 102.87,62.48 | 102.87,62.48 C4.2 | 102.87,62.48 99.57,62.48 98.81,61.72 R10.1 98.81,58.42 97.54,57.15 97.54,41.15 93.73,37.34 93.73,19.3 93.47,19.3 90.93,16.76 IC1.13
INPUTS3  (via drill 0.6)
  Top 0.406: 107.58,63.11 107.44,63.25 | 107.58,63.11 ENC2.B 107.7,63.25 | C6.2 107.7,62.99 107.58,63.11 | IC1.14 90.68,14.22 95.25,18.8 95.25,37.08 99.06,40.89 v99.06,45.47 | 107.7,63.25 107.7,65.02 106.68,66.04 104.65,66.04 102.87,64.26 99.31,64.26 96.52,61.47 R11.1 96.27,51.31 v96.01,51.05 | 107.7,63.25 107.44,62.99
  Bottom 0.406: ENC2.B 107.7,62.99 | v96.01,51.05 96.01,48.51 v99.06,45.47
INPUTS4  (via drill 0.6)
  Top 0.406: R13.1 119.13,61.21 120.4,62.48 C13.2 124.71,62.48 125.52,63.29 ENC3.A 125.52,63.46 | IC1.3 115.32,14.22 116.59,12.95 116.59,8.13 119.63,5.08 128.52,5.08 132.08,8.64 132.08,12.7 135.89,16.51 v135.89,35.05 | v132.84,37.85 128.27,42.42 128.27,56.9 126.75,58.42 126.75,62.23 125.52,63.46 | 125.52,63.46 125.48,63.5
  Bottom 0.406: v135.89,35.05 135.64,35.05 v132.84,37.85
INPUTS5
  Top 0.406: C20.2 ENC3.B 128.02,65.02 127.51,65.53 124.46,65.53 123.44,64.52 119.89,64.52 116.59,61.21 R14.1 | IC1.4 115.32,16.76 117.86,14.22 117.86,8.64 120.14,6.35 127.76,6.35 130.56,9.14 130.56,13.21 134.62,17.27 134.62,42.16 129.54,47.24 129.54,58.42 C20.2 | C20.2 128.27,60.2
INPUTS6  (via drill 0.6)
  Top 0.406: ENC4.A 145.84,63.29 145.03,62.48 C23.2 140.46,62.48 139.45,61.47 139.45,60.2 139.7,59.94 | v101.85,23.37 112.27,23.37 113.54,24.64 113.54,36.58 110.74,39.37 110.74,48.51 v114.05,51.82 | 139.7,59.94 R16.1 | v139.45,53.34 139.45,59.69 139.7,59.94
  Bottom 0.406: IC1.5 99.31,19.3 100.58,20.57 100.58,22.1 v101.85,23.37 | v114.05,51.82 137.92,51.82 v139.45,53.34
INPUTS7  (via drill 0.6)
  Top 0.406: 148.34,63.25 C24.2 | IC1.6 113.28,21.84 114.81,23.37 v114.81,44.7 | 148.34,63.25 ENC4.B | 148.34,63.25 148.34,64.77 147.57,65.53 144.78,65.53 143.51,64.26 139.7,64.26 136.91,61.47 R20.1 136.91,53.09 v134.11,50.29
  Bottom 0.406: v114.81,44.7 114.81,47.75 117.35,50.29 v134.11,50.29 131.83,50.29
INPUTS8  (via drill 0.6)
  Top 0.406: 84.84,77.72 R19.1 | 84.84,77.72 85.09,77.72 85.09,77.61 ENC1.D 84.88,77.68 84.84,77.72 | v87.38,67.56 84.84,70.1 84.84,77.72 | 92.46,60.2 v92.46,64.77 | IC5.11 118.11,21.84 117.35,22.61 117.35,54.61 v116.08,55.88 | v95,55.88 93.73,55.88 92.2,57.4 92.2,59.94 92.46,60.2 | 92.46,60.2 C9.2
  Bottom 0.406: v87.38,67.56 89.66,67.56 v92.46,64.77 | v116.08,55.88 v95,55.88
INPUTS9  (via drill 0.6)
  Top 0.406: 104.9,77.72 R12.1 | 104.9,77.72 105.41,77.72 105.3,77.61 ENC2.D 105.01,77.61 104.9,77.72 | v112.78,65.02 C12.2 112.52,59.94 112.78,59.69 112.78,56.39 116.08,53.09 116.08,21.08 117.86,19.3 IC5.12 | v107.7,67.56 105.16,70.1 105.16,77.47 104.9,77.72
  Bottom 0.406: v112.78,65.02 110.24,67.56 v107.7,67.56
INPUTS10  (via drill 0.6)
  Top 0.406: R15.1 125.48,77.72 125.52,77.68 ENC3.D 125.52,77.94 125.48,77.98 125.48,70.1 v128.02,67.56 | v133.1,65.02 C21.2 133.1,59.69 133.35,59.44 133.35,57.4 131.83,55.88 v131.57,55.88 | IC5.13 120.9,16.76 122.43,18.29 122.43,27.69 118.87,31.24 118.87,54.86 v119.89,55.88
  Bottom 0.406: v133.1,65.02 130.56,67.56 v128.02,67.56 | v119.89,55.88 v131.57,55.88
INPUTS11  (via drill 0.6)
  Top 0.406: 145.8,77.72 R21.1 | C25.2 v153.42,65.02 | v148.34,67.56 145.8,70.1 145.8,77.72 | 145.8,77.72 145.84,77.76 ENC4.D | IC5.14 120.65,14.22 123.95,17.53 123.95,28.45 120.14,32.26 120.14,53.09 v121.16,54.1
  Bottom 0.406: v153.42,65.02 150.88,67.56 v148.34,67.56 | v121.16,54.1 132.33,54.1 134.37,56.13 151.89,56.13 153.42,57.66 153.42,59.69 153.16,59.94 C25.2
INPUTS12  (via drill 0.6)
  Top 0.406: BUTTON1.B@1 R22.1 C5.2 82.3,32 85.6,28.7 87.38,28.7 v89.41,30.73 | IC5.3 129.54,14.22 133.35,18.03 v133.35,29.46
  Bottom 0.406: C5.2 82.3,34.8 | v89.41,30.73 123.44,30.73 | 123.44,30.73 124.46,30.73 | v133.35,29.46 131.57,29.46 130.3,30.73 123.44,30.73
INPUTS13  (via drill 0.6)
  Top 0.406: C10.2 R23.1 BUTTON2.B@1 | IC5.4 129.79,16.76 132.08,19.05 v132.08,32
  Bottom 0.406: 125.22,32 109.98,32 106.68,35.31 104.65,35.31 C10.2 | 125.22,32 125.48,32 | 125.22,32 v132.08,32
INPUTS14  (via drill 0.6)
  Top 0.406: C14.2 R24.1 BUTTON3.B@1 | IC5.5 129.54,19.3 130.81,20.57 130.81,32.77 v129.03,34.54
  Bottom 0.406: v129.03,34.54 127.25,36.32 124.46,36.32 122.94,34.8 C14.2
INPUTS15
  Top 0.406: BUTTON4.B@1 R25.1 C18.2
  Bottom 0.406: IC5.6 140.72,21.84 143.26,24.38 143.26,34.29 143.51,34.54 C18.2
INT  (via drill 0.6)
  Top 0.254: U$2.14 52.48,65.62 v53.09,65.02 53.09,62.99 53.15,63.06 R46.1 | v55.63,44.7 55.63,38.35 IC2.17
  Bottom 0.254: v53.09,65.02 53.34,65.02 54.86,63.5 54.86,54.86 55.63,54.1 v55.63,44.7
LED
  Top 0.406: IC2.5 23.88,35.81 25.4,34.29 33.78,34.29 39.12,28.96 JP1.11
MIDIIN
  Top 0.406: OK1.6 23.11,67.56 24.38,66.29 R7.2
  Bottom 0.406: R7.2 24.38,62.48 25.91,60.96 34.54,60.96 37.85,57.66 37.85,43.18 40.89,40.13 45.47,40.13 46.74,38.86 46.74,37.34 46.99,37.08 IC2.14
MIDIOUT
  Bottom 0.406: R8.2 33.27,72.64 32.26,71.63 32.26,64.26 33.02,63.5 36.32,63.5 41.15,58.67 41.15,56.9 42.93,55.12 42.93,45.72 49.28,39.37 IC2.15
MISO
  Bottom 0.406: ISP.9 46.74,29.46 45.72,30.48 30.73,30.48 28.96,32.26 28.96,36.83 29.21,37.08 IC2.7
MOSI
  Bottom 0.406: 26.42,37.34 IC2.6 26.42,32.26 29.21,29.46 41.66,29.46 45.47,25.65 52.58,25.65 53.09,26.16 53.09,27.43 54.1,28.45 55.37,28.45 ISP.1
N$1
  Bottom 0.406: IC5.10 118.62,24.38 117.35,25.65 101.85,25.65 99.06,28.45 93.73,28.45 92.2,26.92 IC1.9
N$2
  Top 0.406: R1.S JP1.3
N$3
  Top 0.406: D1.A 97.03,84.33 92.46,88.9 | J1.2 92.46,88.9 | J1.3 91.49,91.9 92.46,90.93 92.46,88.9
N$4
  Top 0.406: 49.28,55.63 R3.1 IC2.26
N$5
  Top 0.406: POWER.A 68.33,79.5 66.55,81.28 R2.2
N$7
  Top 0.406: R3.2 57.4,55.37 58.17,54.61 58.17,34.29 61.98,30.48 LED2.A
N$8  (via drill 0.6)
  other vias: 150.62,92.71
N$10
  Top 0.406: IN1.4 13.72,77.98 13.46,77.72 D10.C R6.1 10.92,77.72
N$11
  Top 0.406: R9.1 OUT1.4
N$12
  Top 0.406: R8.1 44.2,75.18 OUT1.5
N$13
  Top 0.406: OK1.2 13.72,70.36 13.46,70.1 R6.2
N$20
  Top 0.406: IN1.5 24.13,80.26 23.88,80.01 D10.A 18.54,77.72 16.51,75.69 16.51,68.83 15.24,67.56 OK1.3
N$21
  Top 0.406: IC4.1 115.32,90.68 113.03,92.96 C2.+ C1.+ 102.62,92.96 101.6,93.98 D1.C
N$22
  Top 0.254: R43.1 62.23,83.82 61.47,84.58 59.69,84.58 59.67,84.56 USB.2
N$23
  Bottom 0.406: IC4.3 96.01,85.34 91.69,89.66 87.38,89.66 85.09,91.95 79.25,91.95 77.98,90.68 POWERSWITCH.3
N$35  (via drill 0.6)
  Top 0.254: U$2.18 58.92,67.58 v58.93,67.56 | R49.1 64.77,69.09 64.52,68.83 v62.74,68.83
  Bottom 0.254: v58.93,67.56 61.47,67.56 v62.74,68.83
N$36
  Top 0.254: U$2.26 59.31,72.78 59.94,73.41 R42.2 59.94,80.26
N$37
  Top 0.254: 61.47,78.23 61.21,77.98 | 61.47,78.23 62.23,78.99 62.23,79.5 62.48,79.76 62.23,80.01 R43.2 | U$2.25 60.19,72.12 60.71,72.64 60.71,77.47 61.47,78.23
N$38
  Top 0.254: 56.64,80.77 C38.1 | 56.64,80.77 56.9,80.77 | U$2.27 57.17,73.42 57.15,73.41 56.64,73.41 56.13,73.91 56.13,74.42 56.64,74.93 58.93,74.93 59.18,75.18 59.18,78.74 58.42,79.5 58.42,80.52 58.17,80.77 56.64,80.77
N$45
  Top 0.254: 60.16,68.88 60.14,68.89 R50.2 | U$2.20 60.16,68.88 | 60.16,68.88 60.2,68.83
N$46
  Top 0.254: U$2.22 65.72,70.17 67.06,68.83 C34.1 69.79,68.89 Q1.2
N$47
  Top 0.254: Q1.1 69.34,72.14 68.83,71.63 67.06,71.63 | 67.06,71.63 C35.1 | U$2.23 66.25,70.83 67.06,71.63
N$48
  Top 0.254: R42.1 58.99,81.98 58.42,82.55 58.42,85.09 59.69,86.36 59.67,86.38 USB.3
N$51
  Top 0.254: R48.2 48.77,60.96 48.83,61.03 R47.1 48.83,63.06 | U$2.12 49.91,66.92 49.02,66.04 49.02,63.25 48.83,63.06 | 48.83,63.06 48.77,62.99
N$98  (via drill 0.6)
  Top 0.406: v40.39,46.23 40.39,42.67 v37.59,39.88
  Bottom 0.406: R5.2 32.51,75.18 31.5,74.17 31.5,63.75 32.77,62.48 34.54,62.48 37.85,59.18 39.37,59.18 40.39,58.17 v40.39,46.23 40.64,45.97 | v37.59,39.88 37.34,39.88 36.83,39.37 34.8,39.37 34.04,38.61 IC2.9 | IC2.9 34.29,36.83 | ISP.5 51.82,27.94 47.24,32.51 35.56,32.51 34.04,34.04 IC2.9
OUT
  Bottom 0.406: IC2.27 46.74,45.21 51.05,40.89 53.34,40.89 55.63,38.61 55.63,34.8 57.15,33.27 76.45,33.27 77.98,31.75 86.36,31.75 88.65,29.46 117.6,29.46 IC5.9
PE
  Bottom 0.406: IN1.PE@ IN1.PE OUT1.PE@ | OUT1.PE@ 36.83,92.96 37.08,92.71 | 42.16,92.96 OUT1.PE OUT1.PE@
RD  (via drill 0.6)
  Top 0.254: U$2.15 57.33,65.61 57.4,65.53 v57.4,64.26
  Top 0.406: IC2.20 63.5,37.08 64.26,37.85 64.26,59.94 61.98,62.23 v58.42,62.23
  Bottom 0.254: v58.42,62.23 57.91,62.23 57.15,62.99 57.15,64.01 v57.4,64.26
RS  (via drill 0.6)
  Top 0.406: v24.13,47.5 52.83,47.5 54.36,49.02 54.36,52.07 54.1,52.32 IC2.24
  Bottom 0.406: JP1.4 21.34,34.54 22.61,35.81 22.61,45.97 v24.13,47.5
SCK
  Bottom 0.406: ISP.7 49.28,28.7 46.48,31.5 33.27,31.5 31.5,33.27 IC2.8
SCL  (via drill 0.6)
  Top 0.406: v77.47,43.94 77.47,25.15 76.71,24.38 IC7.6
  Bottom 0.406: IC2.22 59.44,51.05 60.96,49.53 71.88,49.53 v77.47,43.94
SDA  (via drill 0.6)
  Top 0.406: IC7.5 v74.68,44.96
  Bottom 0.406: IC2.23 56.9,51.82 57.15,51.82 60.45,48.51 71.12,48.51 v74.68,44.96
SH  (via drill 0.6)
  Top 0.406: v69.34,24.13 69.34,12.95 73.66,8.64 86.36,8.64 88.14,10.41 96.01,10.41 97.54,8.89 IC1.1
  Bottom 0.406: IC5.1 126.24,7.62 116.84,7.62 115.32,9.14 97.79,9.14 97.54,8.89 IC1.1 | IC2.28 44.2,46.23 50.8,39.62 52.07,39.62 53.09,38.61 53.09,32.77 59.94,25.91 67.56,25.91 v69.34,24.13
SUSPEND  (via drill 0.6)
  Top 0.254: R48.1 52.07,60.96 52.83,60.2 v52.83,59.94
  Bottom 0.254: v52.83,59.94 53.09,59.69 53.09,43.18 56.9,39.37 IC2.18 56.9,36.83
USBDATA0
  Top 0.254: U$2.1 45.12,74.08 41.91,70.87 32.51,70.87 23.88,62.23 16.51,62.23 13.72,59.44 IC2.40 13.72,52.07
USBDATA1
  Top 0.254: U$2.2 45.48,73.42 42.16,70.1 32.77,70.1 24.13,61.47 18.29,61.47 16.26,59.44 IC2.39 16.26,52.07
USBDATA2
  Top 0.254: U$2.3 45.85,72.78 42.42,69.34 33.02,69.34 24.38,60.71 20.57,60.71 18.8,58.93 IC2.38 18.8,52.07
USBDATA3
  Top 0.254: U$2.4 46.22,72.12 42.67,68.58 33.27,68.58 21.34,56.64 IC2.37 21.34,52.07
USBDATA4
  Top 0.254: U$2.6 45.93,70.83 42.93,67.82 33.53,67.82 23.88,58.17 IC2.36 23.88,52.07
USBDATA5
  Top 0.254: U$2.7 46.3,70.17 43.18,67.06 33.78,67.06 26.42,59.69 IC2.35 26.67,52.07
USBDATA6
  Top 0.254: U$2.8 46.66,69.53 43.43,66.29 34.04,66.29 28.96,61.21 IC2.34 28.96,52.07
USBDATA7
  Top 0.254: U$2.9 47.03,68.88 43.69,65.53 34.29,65.53 31.5,62.74 IC2.33
VCC  (via drill 0.6)  (1 unrouted)
  Top 0.254: 56.13,68.22 56.03,68.22 55.05,67.24 R46.2 58.67,63.25 60.71,65.28 R50.1 R49.2 | 56.13,68.22 U$2.19 | 55.88,71.12 56.23,71.47 U$2.24 64.62,71.47 64.77,71.63 C39.1 | 56.13,68.22 56.13,68.33 55.88,68.58 55.88,71.12 | 55.88,71.12 v55.37,71.63 | 64.77,67.06 64.77,67.31 | 54.86,63.25 54.61,63.25 | R49.2 65.22,67 65.28,67.06 64.77,67.06 | R49.2 64.77,67.06 | R47.2 51.31,63.25 51.31,62.48 52.07,61.72 53.09,61.72 | 53.09,61.72 54.1,61.72 55.12,62.74 | 53.09,61.72 52.83,61.72
  Top 0.406: R17.2 R18.2 | R11.2 R10.2 R12.2 | R13.2 R14.2 | R17.2 R19.2 | R13.2 119.13,67.31 | R13.2 R15.2 | R21.2 R16.2 R20.2 | R23.2 109.22,37.08 106.43,39.88 106.43,47.24 103.89,49.78 v103.89,57.4 | R22.2 88.65,37.08 86.11,39.62 86.11,47.24 83.57,49.78 v83.57,57.4 | R24.2 127,39.88 127,46.99 124.21,49.78 v124.21,57.4 | R25.2 149.86,37.08 147.07,39.88 147.07,47.24 144.53,49.78 v144.53,57.4 | C11.+ IC7.8 74.68,19.56 74.42,19.3 | OK1.8 R7.1 25.91,72.64 27.43,74.17 27.43,75.44 28.45,76.45 40.39,76.45 R9.2 R5.1 | IC2.10 36.58,42.16 v39.12,44.7 | IC2.32 34.04,53.59 35.31,54.86 38.1,54.86 39.12,53.85 IC2.30 C3.+ 41.15,59.44 42.67,59.44 43.69,58.42 53.34,58.42 55.12,60.2 55.12,62.74 55.12,62.99 54.86,63.25 R46.2 | 16.26,19.05 R1.E JP1.2 16.26,31.75 11.94,36.07 11.94,38.35 13.21,39.62 34.04,39.62 IC2.10 | IC2.10 36.83,36.83 | 65.28,67.06 65.28,65.53 66.04,64.77 76.2,64.77 78.74,67.31 R17.2 | v87.38,33.02 87.38,30.48 v86.61,29.72 | C15.+ 80.52,84.58 77.22,84.58 | 77.22,84.58 76.45,84.58 73.91,87.12 POWERSWITCH.2 | 77.22,84.58 R2.1
  Bottom 0.254: R5.1 51.82,75.18 v55.37,71.63
  Bottom 0.406: R10.2 100.08,66.29 100.08,58.93 100.2,58.8 | 100.2,58.8 101.35,57.66 v103.89,57.4 119.13,57.4 120.4,58.67 | R17.2 80.01,66.29 80.01,58.67 81.28,57.4 v83.57,57.4 99.06,57.66 100.2,58.8 | 120.4,58.67 121.67,57.4 v124.21,57.4 139.45,57.4 140.72,58.67 | R13.2 119.38,67.56 120.4,66.55 120.4,58.67 | v144.53,57.4 141.99,57.4 140.72,58.67 | R16.2 139.7,67.56 140.72,66.55 140.72,58.67 | IC5.16 117.35,9.14 116.08,10.41 94.74,10.41 93.47,9.14 IC1.16 87.38,11.68 87.38,20.32 | R22.2 87.38,34.54 v87.38,33.02 | v39.12,44.7 IC2.30 | ISP.2 67.06,24.38 72.14,19.3 IC7.8 74.93,19.05 74.93,19.3 76.2,20.57 87.38,20.57 87.38,20.32 | v86.61,29.72 86.61,21.08 87.38,20.32 | R19.2 77.22,72.9 79.5,75.18 79.5,81.28 81.03,82.8 82.04,82.8 82.3,82.55 C15.+ | R21.2 139.45,67.31 138.94,66.8
  other vias: 132.84,85.09 127.76,85.09 125.22,85.09 122.68,85.09 122.68,87.63 122.68,90.17 122.68,92.71 137.92,92.71 137.92,90.17 135.38,85.09 137.92,85.09 143,85.09 140.46,90.17 140.46,92.71 145.54,92.71 145.54,90.17 148.08,85.09 150.62,85.09 150.62,90.17
  pour Bottom: 119.38,93.98 119.38,82.3 151.89,82.3 151.89,93.98
  pour Top (isolate 0.381): 119.38,93.98 119.38,82.3 151.89,82.3 151.89,93.98
VCCINT  (via drill 0.6)
  Top 0.254: 55.63,76.2 C36.1 | C37.1 55.56,76.27 55.63,76.2 | 55.63,76.2 56.9,76.2 v57.15,76.45
  Bottom 0.254: USB.1 57.17,84.35 57.15,84.33 v57.15,76.45
  Bottom 0.406: USB.1 57.17,84.6 58.42,85.85 58.42,87.63 59.18,88.39 60.71,88.39 62.23,86.87 69.34,86.87 71.37,88.9 POWERSWITCH.1
WR  (via drill 0.6)
  Top 0.254: IC2.21 61.98,52.07 | U$2.16 57.93,66.28 v58.93,65.28
  Top 0.406: IC2.21 61.98,59.69 v60.71,60.96
  Bottom 0.254: v58.93,65.28 60.45,63.75 60.45,61.21 v60.71,60.96

### Text on the board
Top: TOP
Bottom: BOT
tNames: MISO | SCK | RST | MOSI | RUIN & WESEN | DEVEL BOARD MIDI COMMAND | 1.0 - 2008 | http://ruinwesen.com/